# Altium schematic sheet Ethernet-Debug.SchDoc
size OrCAD B; SheetNumber: 8; SheetTotal: 12
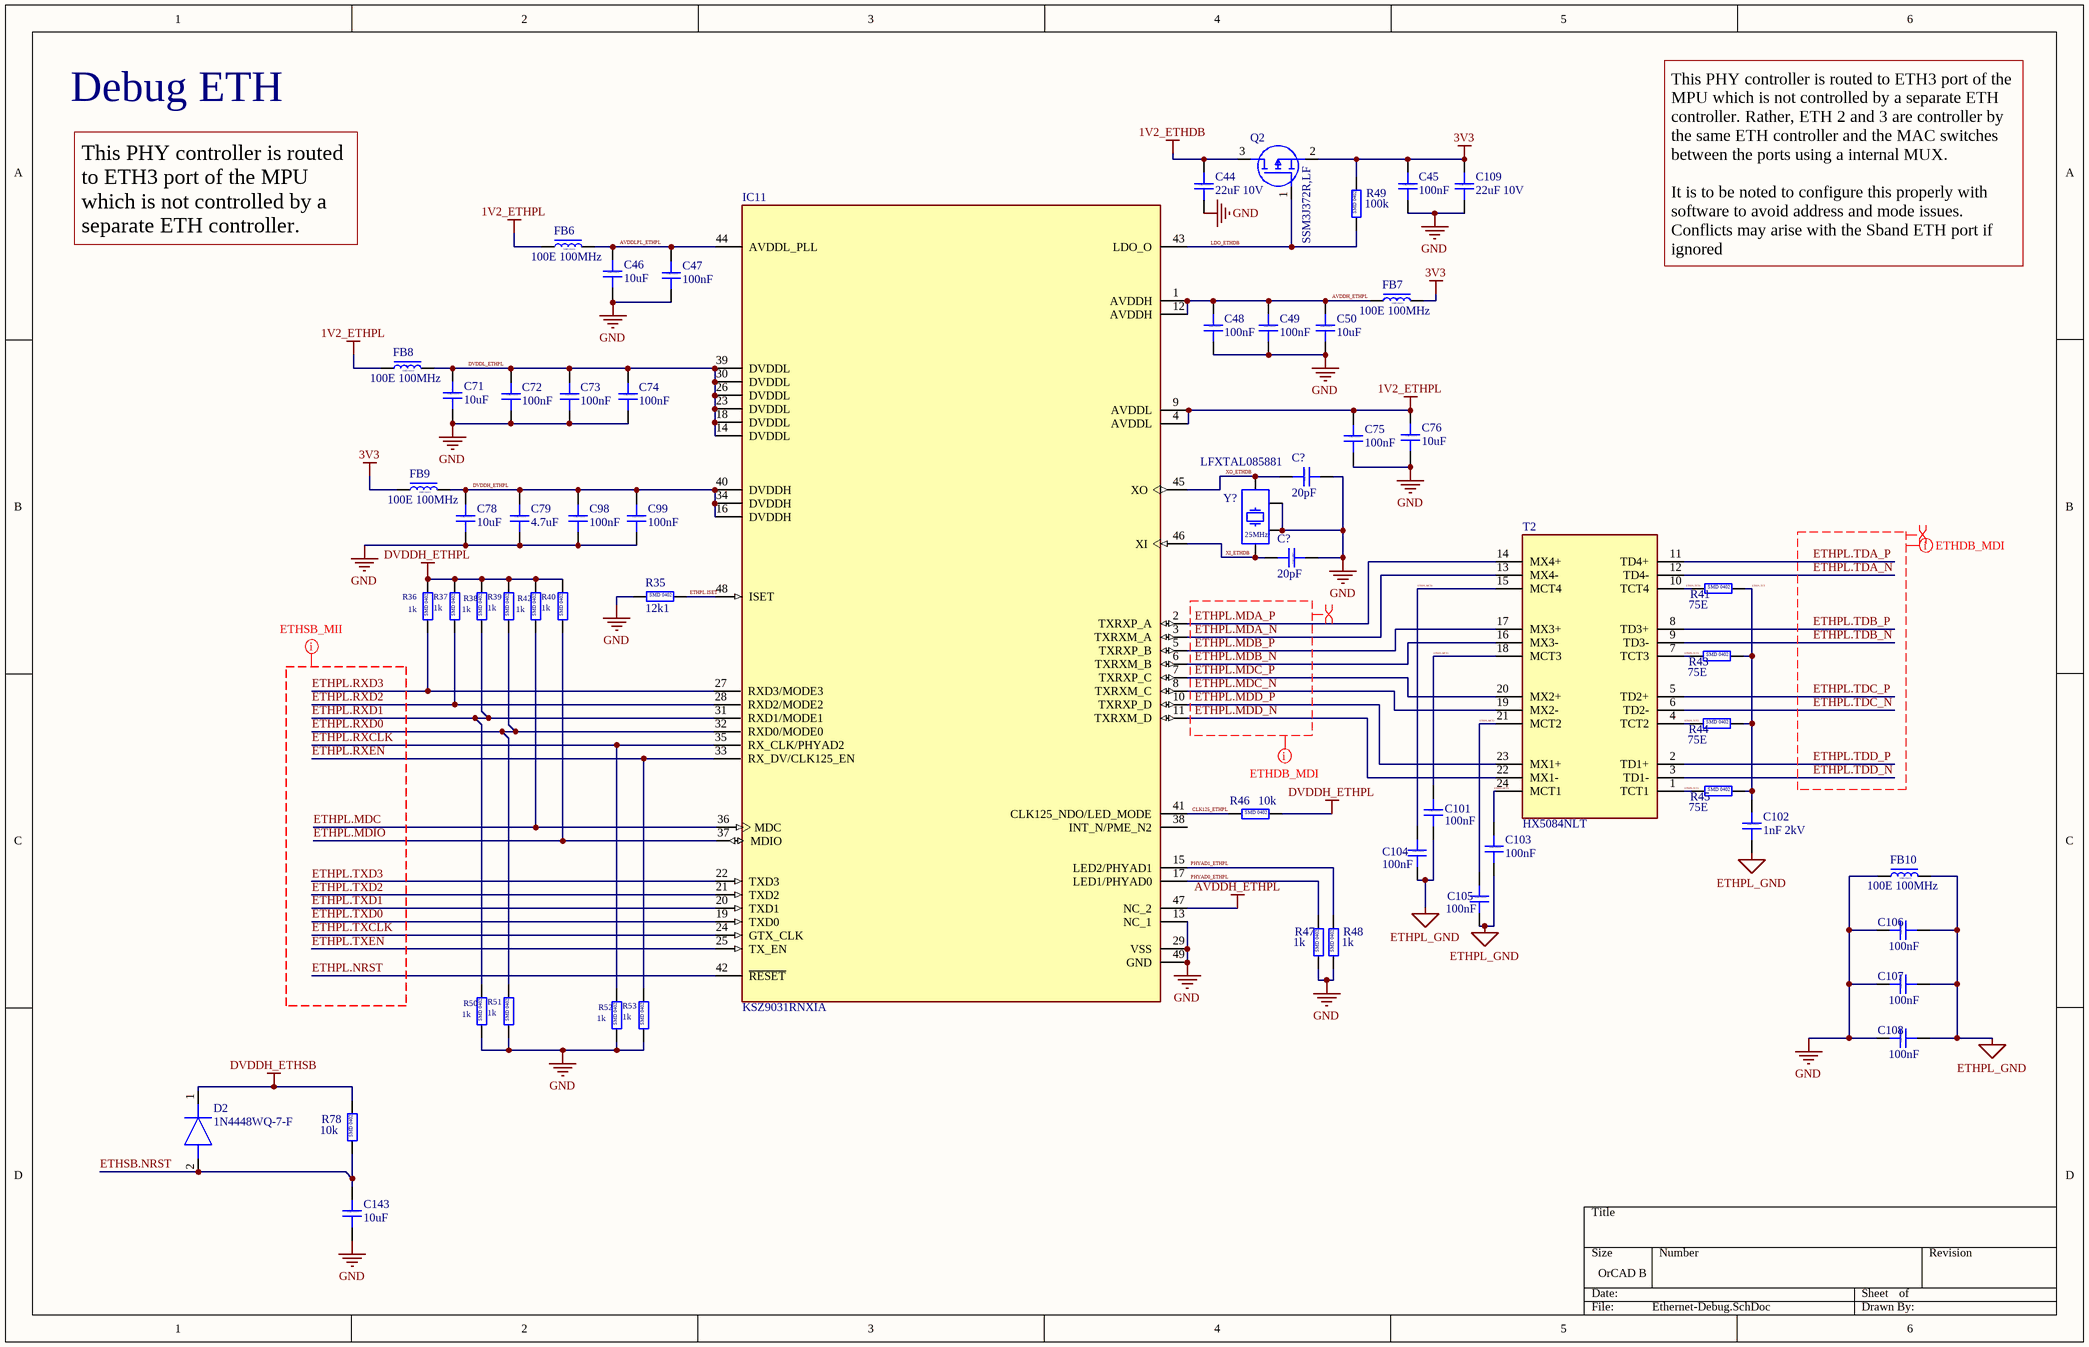
[diagram p0: Ethernet-Debug.SchDoc]

## Parts
(Parts that share a designator on the sheet are numbered #1, #2 ... from top to bottom, then left to right.)
C44  22uF 10V  [CAP_0805]
C45  100nF  [CAP_0402]
C46  10uF  [CAP_0603]
C47  100nF  [CAP_0402]
C48  100nF  [CAP_0402]
C49  100nF  [CAP_0402]
C50  10uF  [CAP_0603]
C71  10uF  [CAP_0603]
C72  100nF  [CAP_0402]
C73  100nF  [CAP_0402]
C74  100nF  [CAP_0402]
C75  100nF  [CAP_0402]
C76  10uF  [CAP_0603]
C78  10uF  [CAP_0603]
C79  4.7uF  [CAP_0603]
C98  100nF  [CAP_0402]
C99  100nF  [CAP_0402]
C101  100nF  [CAP_0402]
C102  1nF 2kV  [CAP_0402]
C103  100nF  [CAP_0402]
C104  100nF  [CAP_0402]
C105  100nF  [CAP_0402]
C106  100nF  [CAP_0402]
C107  100nF  [CAP_0402]
C108  100nF  [CAP_0402]
C109  22uF 10V  [CAP_0805]
C143  10uF  [CAP_0603]
C?#1  20pF  [CAP_0402]
C?#2  20pF  [CAP_0402]
D2  1N4448WQ-7-F  [SOD3716X135N]
FB6  100E 100MHz  [FB_0603]
FB7  100E 100MHz  [FB_0603]
FB8  100E 100MHz  [FB_0603]
FB9  100E 100MHz  [FB_0603]
FB10  100E 100MHz  [FB_0603]
IC11  KSZ9031RNXIA  [QFN50P700X700X90-49N]
Q2  SSM3J372R,LF  [SSM3J372RLF]
R35  12k1  [RES_0402]
R36  1k  [RES_0402]
R37  1k  [RES_0402]
R38  1k  [RES_0402]
R39  1k  [RES_0402]
R40  1k  [RES_0402]
R41  75E  [RES_0402]
R42  1k  [RES_0402]
R43  75E  [RES_0402]
R44  75E  [RES_0402]
R45  75E  [RES_0402]
R46  10k  [RES_0402]
R47  1k  [RES_0402]
R48  1k  [RES_0402]
R49  100k  [RES_0402]
R50  1k  [RES_0402]
R51  1k  [RES_0402]
R52  1k  [RES_0402]
R53  1k  [RES_0402]
R78  10k  [RES_0402]
T2  HX5084NLT  [HX5084NLT]
Y?  LFXTAL085881  [CRY-SMD-3225]

## Nets
1V2_ETHDB: C44.1 Q2.3(D)
1V2_ETHPL: C75.1 C76.1 FB6.1 FB8.1 IC11.4(AVDDL) IC11.9(AVDDL)
3V3: C45.1 C109.1 FB7.2 FB9.1 Q2.2(S) R49.2
AVDDH_ETHPL: C48.1 C49.1 C50.1 FB7.1 IC11.1(AVDDH) IC11.12(AVDDH) IC11.47(NC_2)
DVDDH_ETHPL: C78.1 C79.1 C98.1 C99.1 FB9.2 IC11.16(DVDDH) IC11.34(DVDDH) IC11.40(DVDDH) R36.2 R37.2 R38.2 R39.2 R40.2 R42.2 R46.2
DVDDH_ETHSB: D2.1(K) R78.2
ETHPL_GND: C101.2 C102.2 C103.2 C104.2 C105.2 C106.2 C107.2 C108.2 FB10.2
GND: C44.2 C45.2 C46.2 C47.2 C48.2 C49.2 C50.2 C71.2 C72.2 C73.2 C74.2 C75.2 C76.2 C78.2 C79.2 C98.2 C99.2 C106.1 C107.1 C108.1 C109.2 C143.2 C?#1.2 C?#2.1 FB10.1 IC11.13(NC_1) IC11.29(VSS) IC11.49(GND) R35.1 R47.1 R48.1 R50.1 R51.1 R52.1 R53.1 Y?.2 Y?.4
AVDDLPL_ETHPL: C46.1 C47.1 FB6.2 IC11.44(AVDDL_PLL)
CLK125_ETHPL: IC11.41(CLK125_NDO/LED_MODE) R46.1
DVDDL_ETHPL: C71.1 C72.1 C73.1 C74.1 FB8.2 IC11.14(DVDDL) IC11.18(DVDDL) IC11.23(DVDDL) IC11.26(DVDDL) IC11.30(DVDDL) IC11.39(DVDDL)
ETHPL.ISET: IC11.48(ISET) R35.2
ETHPL.MCT1: C103.1 T2.24(MCT1)
ETHPL.MCT2: C105.1 T2.21(MCT2)
ETHPL.MCT3: C101.1 T2.18(MCT3)
ETHPL.MCT4: C104.1 T2.15(MCT4)
ETHPL.MDA_N: IC11.3(TXRXM_A) T2.13(MX4-)
ETHPL.MDA_P: IC11.2(TXRXP_A) T2.14(MX4+)
ETHPL.MDB_N: IC11.6(TXRXM_B) T2.16(MX3-)
ETHPL.MDB_P: IC11.5(TXRXP_B) T2.17(MX3+)
ETHPL.MDC: IC11.36(MDC) R42.1
ETHPL.MDC_N: IC11.8(TXRXM_C) T2.19(MX2-)
ETHPL.MDC_P: IC11.7(TXRXP_C) T2.20(MX2+)
ETHPL.MDD_N: IC11.11(TXRXM_D) T2.22(MX1-)
ETHPL.MDD_P: IC11.10(TXRXP_D) T2.23(MX1+)
ETHPL.MDIO: IC11.37(MDIO) R40.1
ETHPL.NRST: IC11.42(~{RESET})
ETHPL.RXCLK: IC11.35(RX_CLK/PHYAD2) R52.2
ETHPL.RXD0: IC11.32(RXD0/MODE0) R39.1 R51.2
ETHPL.RXD1: IC11.31(RXD1/MODE1) R38.1 R50.2
ETHPL.RXD2: IC11.28(RXD2/MODE2) R37.1
ETHPL.RXD3: IC11.27(RXD3/MODE3) R36.1
ETHPL.RXEN: IC11.33(RX_DV/CLK125_EN) R53.2
ETHPL.TCT: C102.1 R41.2 R43.2 R44.2 R45.2
ETHPL.TCT1: R45.1 T2.1(TCT1)
ETHPL.TCT2: R44.1 T2.4(TCT2)
ETHPL.TCT3: R43.1 T2.7(TCT3)
ETHPL.TCT4: R41.1 T2.10(TCT4)
ETHPL.TDA_N: T2.12(TD4-)
ETHPL.TDA_P: T2.11(TD4+)
ETHPL.TDB_N: T2.9(TD3-)
ETHPL.TDB_P: T2.8(TD3+)
ETHPL.TDC_N: T2.6(TD2-)
ETHPL.TDC_P: T2.5(TD2+)
ETHPL.TDD_N: T2.3(TD1-)
ETHPL.TDD_P: T2.2(TD1+)
ETHPL.TXCLK: IC11.24(GTX_CLK)
ETHPL.TXD0: IC11.19(TXD0)
ETHPL.TXD1: IC11.20(TXD1)
ETHPL.TXD2: IC11.21(TXD2)
ETHPL.TXD3: IC11.22(TXD3)
ETHPL.TXEN: IC11.25(TX_EN)
ETHSB.NRST: C143.1 D2.2(A) R78.1
LDO_ETHDB: IC11.43(LDO_O) Q2.1(G) R49.1
PHYAD0_ETHPL: IC11.17(LED1/PHYAD0) R47.2
PHYAD1_ETHPL: IC11.15(LED2/PHYAD1) R48.2
XI_ETHDB: C?#2.2 IC11.46(XI) Y?.1
XO_ETHDB: C?#1.1 IC11.45(XO) Y?.3

Not connected (* = marked no-connect by the designer): IC11 38(INT_N/PME_N2)

## Layout directives
net class ETHSB_MII; rule Maximum Via Count Constraint [Max Count = 2]; rule Matched Net Lengths [Delay Tolerance = 360ps]; rule Length Constraint [Min Length = 0mm    Max Length = 300mm]: ETHPL.MDC, ETHPL.MDIO, ETHPL.NRST, ETHPL.RXCLK, ETHPL.RXD0, ETHPL.RXD1, ETHPL.RXD2, ETHPL.RXD3, ETHPL.RXEN, ETHPL.TXCLK, ETHPL.TXD0, ETHPL.TXD1, ETHPL.TXD2, ETHPL.TXD3, ETHPL.TXEN
differential pair: ETHPL.MDA_N, ETHPL.MDA_P, ETHPL.MDB_N, ETHPL.MDB_P, ETHPL.MDC_N, ETHPL.MDC_P, ETHPL.MDD_N, ETHPL.MDD_P, ETHPL.TDA_N, ETHPL.TDA_P, ETHPL.TDB_N, ETHPL.TDB_P, ETHPL.TDC_N, ETHPL.TDC_P, ETHPL.TDD_N, ETHPL.TDD_P
net class ETHDB_MDI; rule Maximum Via Count Constraint [Max Count = 2]; rule Matched Net Lengths [Delay Tolerance = 100ps]; rule Length Constraint [Min Length = 150mm    Max Length = 2540mm]: ETHPL.MDA_N, ETHPL.MDA_P, ETHPL.MDB_N, ETHPL.MDB_P, ETHPL.MDC_N, ETHPL.MDC_P, ETHPL.MDD_N, ETHPL.MDD_P
net class ETHDB_MDI; rule Maximum Via Count Constraint [Max Count = 2]; rule Matched Net Lengths [Delay Tolerance = 100ps]; rule Length Constraint [Min Length = 0mm    Max Length = 150mm]: ETHPL.TDA_N, ETHPL.TDA_P, ETHPL.TDB_N, ETHPL.TDB_P, ETHPL.TDC_N, ETHPL.TDC_P, ETHPL.TDD_N, ETHPL.TDD_P

## Notes on the sheet
- Debug ETH
- This PHY controller is routed to ETH3 port of the MPU which is not controlled by a separate ETH controller. Rather, ETH 2 and 3 are controller by the same ETH controller and the MAC switches between the ports using a internal MUX.
  It is to be noted to configure this properly with software to avoid address and mode issues. Conflicts may arise with the Sband ETH port if ignored
- (in symbol Capacitor-SMD-0402) SMD 0402
- (in symbol Capacitor-SMD-0603) SMD 0603
- (in symbol Capacitor-SMD-0805) SMD 0805
- (in symbol FB_0603) SMD 0603
- (in symbol LFXTAL085881) 25MHz
- (in symbol Resistor-SMD-0402) SMD 0402

## Library data of the parts
C44 C109 = Capacitor-SMD-0805: Capacitor SMD 0805 RATED
C45 C47-C49 C72-C75 C98 C99 C101-C108 C?#1 C?#2 = Capacitor-SMD-0402: Capacitor SMD 0402 RATED
C46 C50 C71 C76 C78 C79 C143 = Capacitor-SMD-0603: Capacitor SMD 0603 RATED
D2 = 1N4448WQ-7-F: Diode 100V 4A; Manufacturer_Name: Diodes Incorporated; Datasheet Link: http://www.mouser.com/ds/2/115/ds12002-536532.pdf; Height: 1.35mm; Manufacturer_Part_Number: 1N4448WQ-7-F; Mouser Part Number: 621-1N4448WQ-7-F; Mouser Price/Stock: https://www.mouser.co.uk/ProductDetail/Diodes-Incorporated/1N4448WQ-7-F?qs=s5XU71A7K78gaRcR8oskdg%3D%3D; Arrow Part Number: 1N4448WQ-7-F; Arrow Price/Stock: https://www.arrow.com/en/products/1n4448wq-7-f/diodes-incorporated?utm_currency=USD&region=nac
FB6-FB10 = FB_0603: Ferrite Bead SMD 0603; Manufacturer: *; Manufacturer Part Number: *; Distributor Link: *; LCSC: *
IC11 = KSZ9031RNXIA: RGMII Ethernet Transceiver with VDDL LDO; Manufacturer_Name: Microchip; Datasheet Link: https://ww1.microchip.com/downloads/en/devicedoc/00002117f.pdf; Height: 0.9mm; Manufacturer_Part_Number: KSZ9031RNXIA; Mouser Part Number: 998-KSZ9031RNXIA; Mouser Price/Stock: https://www.mouser.co.uk/ProductDetail/Microchip-Technology/KSZ9031RNXIA?qs=lBdOJv1PVCGadCZMzb63mg%3D%3D; Arrow Part Number: KSZ9031RNXIA; Arrow Price/Stock: https://www.arrow.com/en/products/ksz9031rnxia/microchip-technology?region=europe
Q2 = SSM3J372R,LF: MOSFET (P-Channel); Manufacturer_Name: Toshiba; Datasheet Link: https://toshiba.semicon-storage.com/ap-en/semiconductor/product/mosfets/detail.SSM3J372R.html; Height: 0.88mm; Manufacturer_Part_Number: SSM3J372R,LF; Mouser Part Number: 757-SSM3J372RLF; Mouser Price/Stock: https://www.mouser.co.uk/ProductDetail/Toshiba/SSM3J372RLF?qs=u16ybLDytRbJaSMlwq9MLA%3D%3D; Arrow Part Number: SSM3J372R,LF; Arrow Price/Stock: null?utm_currency=USD&region=nac
R35-R53 R78 = Resistor-SMD-0402: Resistor SMD 0402 RATED
T2 = HX5084NLT: Ethernet Signal Transformer; Manufacturer_Name: YAGEO; Datasheet Link: https://productfinder.pulseelectronics.com/api/open/part-attachments/datasheet/hx5084nlt; Height: 4.1402mm; Manufacturer_Part_Number: HX5084NLT; Mouser Part Number: 673-HX5084NLT; Mouser Price/Stock: https://www.mouser.co.uk/ProductDetail/Pulse-Electronics/HX5084NLT?qs=afupL77xwePI46UjbaB5Gg%3D%3D; Arrow Part Number: HX5084NLT; Arrow Price/Stock: https://www.arrow.com/en/products/hx5084nlt/pulse-electronics-corporation?utm_currency=USD&region=nac
Y? = LFXTAL085881: Crystal Oscillator 25MHz; Manufacturer_Name: IDQ; Datasheet Link: https://www.mouser.in/datasheet/3/1460/1/LFXTAL085881.pdf; Height: 0.8mm; Manufacturer_Part_Number: LFXTAL085881